# EAGLE design osmc_strip_2 (EAGLE 5.06)
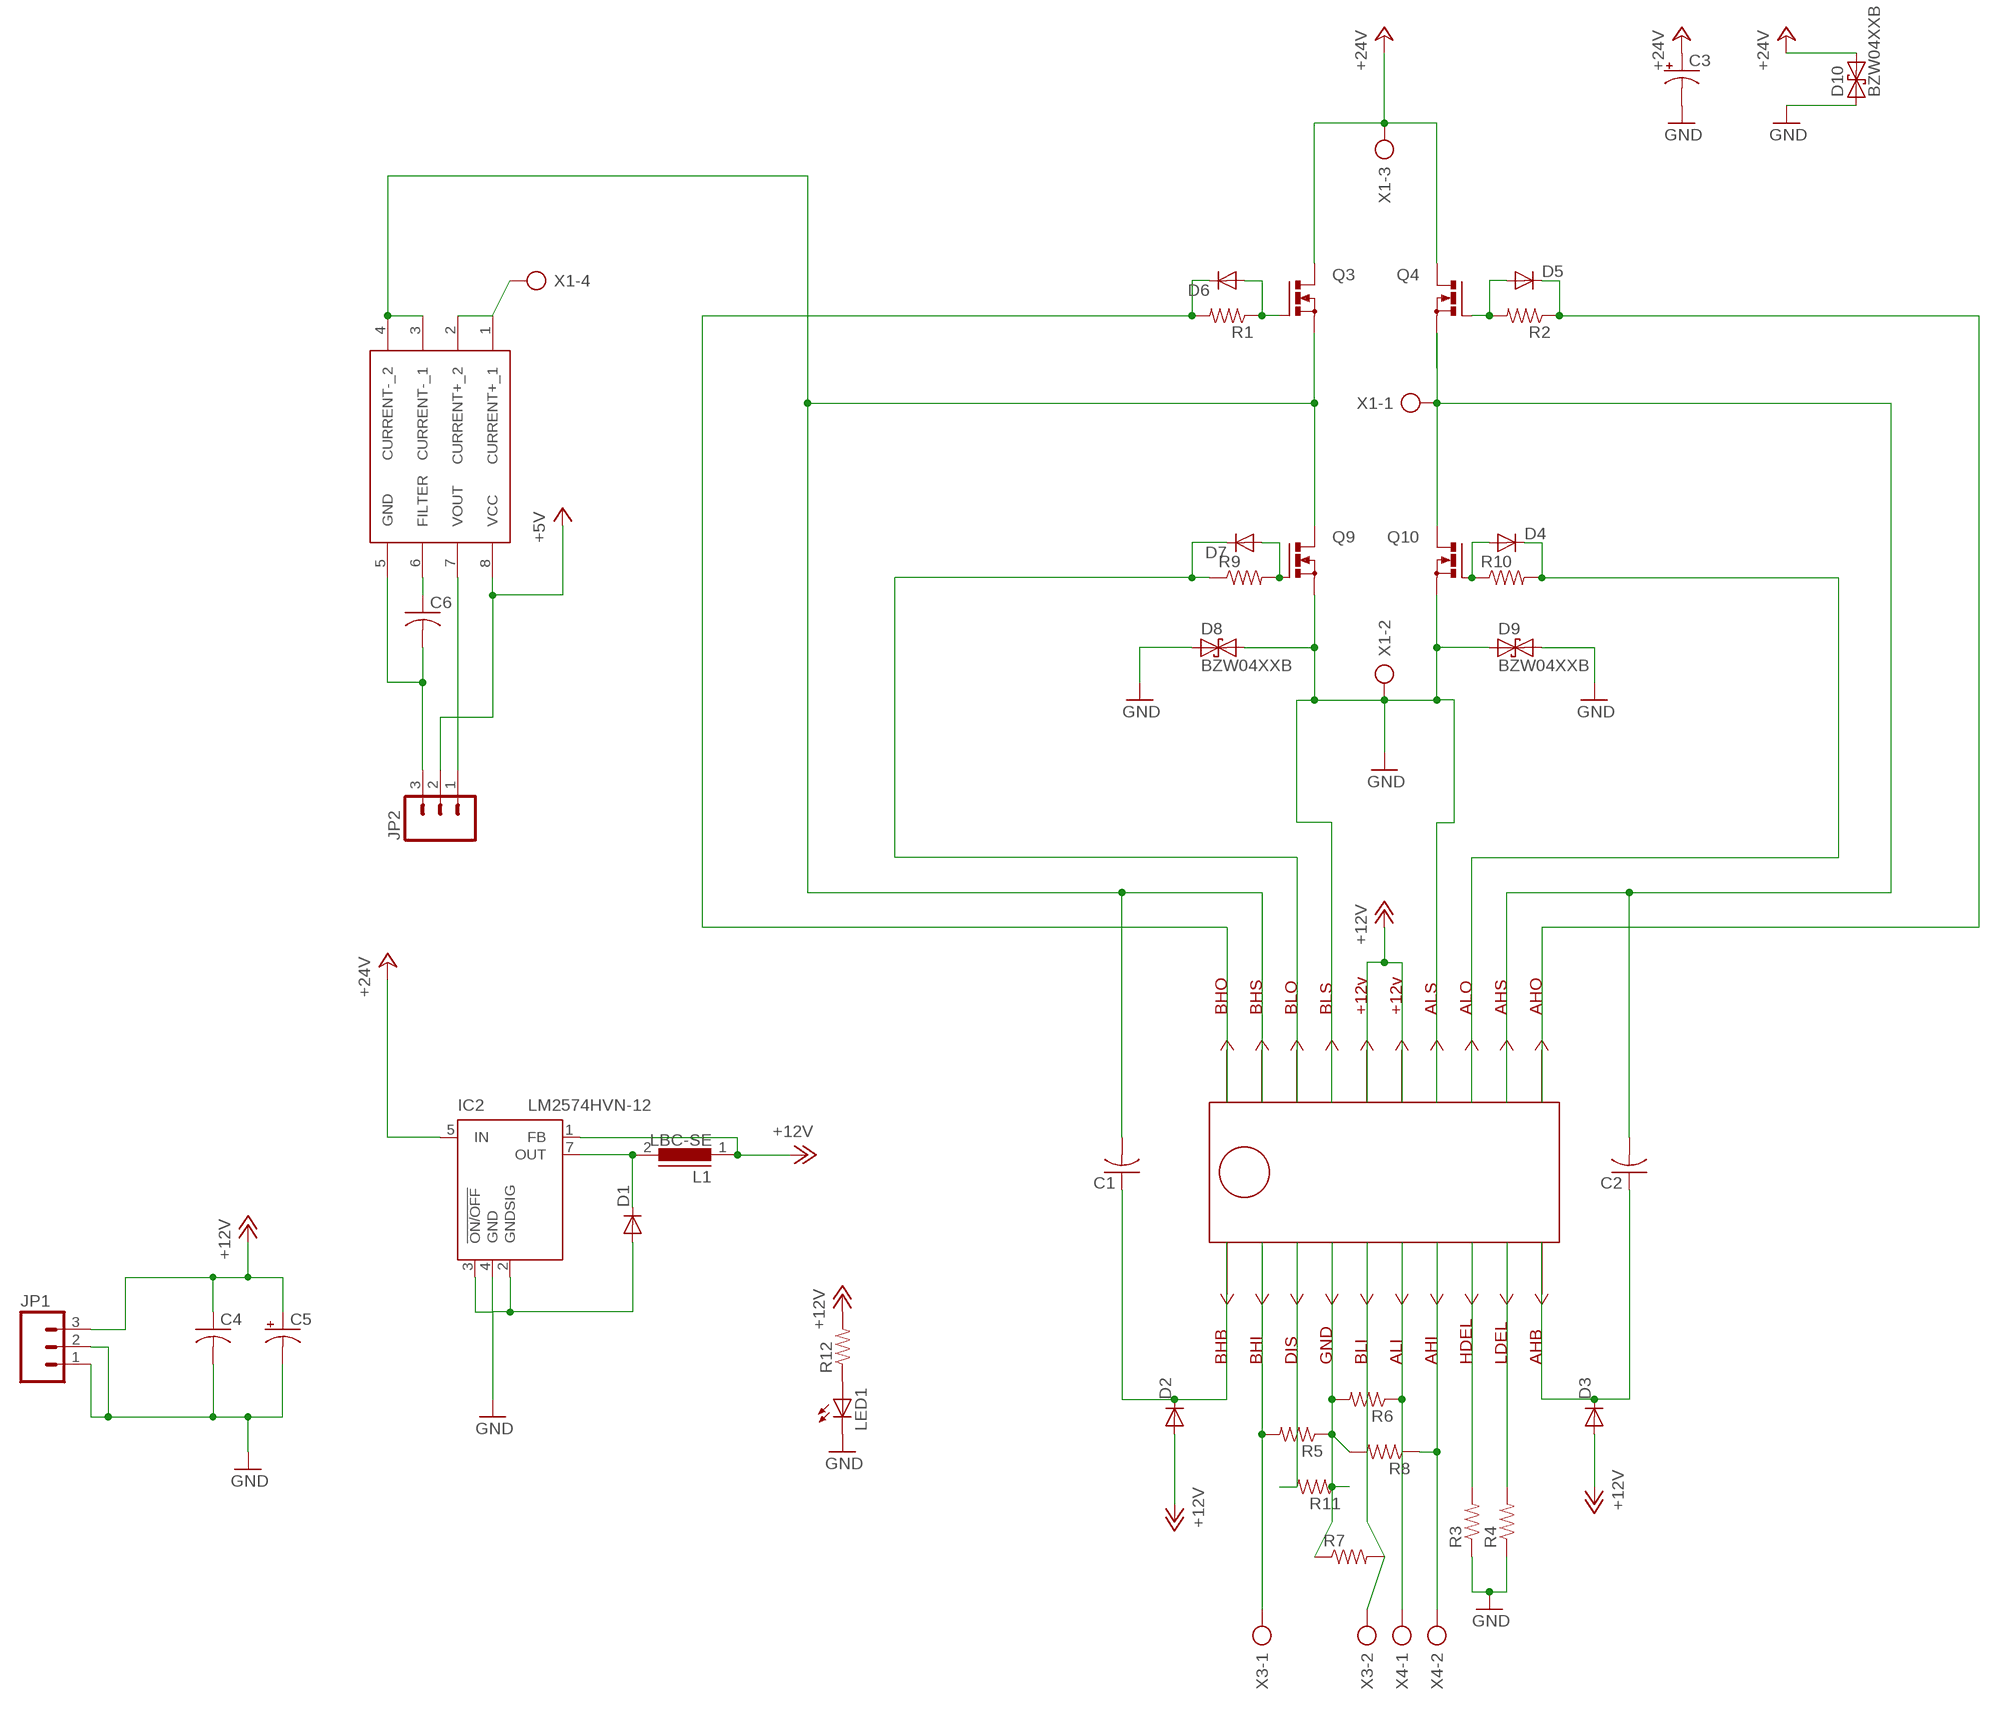
[diagram p0: schematic, sheet 1]

## Parts
C1  C-US075-032X103  [C075-032X103]
C2  C-US075-032X103  [C075-032X103]
C3  CPOL-USE5-13  [E5-13]
C4  C-US025-025X050  [C025-025X050]
C5  CPOL-USE5-8.5  [E5-8,5]
C6  C-US025-024X044  [C025-024X044]
D1  DIODEPTH  [DIODE-1N4001]
D2  DIODEPTH  [DIODE-1N4001]
D3  DIODEPTH  [DIODE-1N4001]
D4  DIODE1N4148  [DIODE-1N4148]
D5  DIODE1N4148  [DIODE-1N4148]
D6  DIODE1N4148  [DIODE-1N4148]
D7  DIODE1N4148  [DIODE-1N4148]
D8  BZW04XXB  [F126Z12]
D9  BZW04XXB  [F126Z12]
D10  BZW04XXB  [F126Z12]
IC1  HIP4081  [HIP4081]
IC2  LM2574HVN-12  [DIL08]
JP1  M03PTH  [1X03]
JP2  M03PTH  [1X03]
L1  LBC-SE  [LBC-SE]
LED1  LED3MM  [LED3MM]
Q3  PMOSFET_NTO220BV  [TO220BV]
Q4  PMOSFET_NTO220BV  [TO220BV]
Q9  PMOSFET_NTO220BV  [TO220BV]
Q10  PMOSFET_NTO220BV  [TO220BV]
R1  RESISTORPTH1  [AXIAL-0.3]
R2  RESISTORPTH1  [AXIAL-0.3]
R3  RESISTORPTH-1/6W  [1/6W-RES]
R4  RESISTORPTH-1/6W  [1/6W-RES]
R5  RESISTORPTH-1/6W  [1/6W-RES]
R6  RESISTORPTH-1/6W  [1/6W-RES]
R7  RESISTORPTH-1/6W  [1/6W-RES]
R8  RESISTORPTH-1/6W  [1/6W-RES]
R9  RESISTORPTH1  [AXIAL-0.3]
R10  RESISTORPTH1  [AXIAL-0.3]
R11  RESISTORPTH-1/6W  [1/6W-RES]
R12  RESISTORPTH-1/6W  [1/6W-RES]
U$1  ACS714  [ACS714]
X1  AK500/4  [AK500/4]
X3  AK500/2  [AK500/2]
X4  AK500/2  [AK500/2]

## Nets
+5V: JP2.2 U$1.8(VCC)
+12V: C4.1 C5.+ D2.A D3.A IC1.15(VCC) IC1.16(+12V) IC2.1(FB) JP1.3 L1.1 R12.2
+24V: C3.+ D10.C IC2.5(IN) Q3.D Q4.D X1.3
GND: C3.- C4.2 C5.- D1.A D8.A D8.C D9.A D9.C D10.A IC1.4(GND) IC1.14(ALS) IC1.17(BLS) IC2.2(GNDSIG) IC2.3(!ON/OFF) IC2.4(GND) JP1.1 JP1.2 LED1.K(C) Q9.S Q10.S R3.1 R4.1 R5.1 R6.2 R7.1 R8.2 R11.1 X1.2
N$2: C2.2 IC1.12(AHS) Q4.S Q10.D X1.1
N$3: D5.C IC1.11(AHO) R2.P$1
N$4: C1.1 D2.C IC1.1(BHB)
N$5: IC1.2(BHI) R5.2 X3.1
N$6: D5.A Q4.G R2.P$2
N$7: IC1.3(DIS) R11.2
N$8: D4.A Q10.G R10.P$1
N$9: IC1.7(AHI) R8.1 X4.2
N$10: IC1.5(BLI) R7.2 X3.2
N$11: IC1.6(ALI) R6.1 X4.1
N$12: D7.A Q9.G R9.P$2
N$13: C6.2 JP2.3 U$1.5(GND)
N$14: C2.1 D3.C IC1.10(AHB)
N$15: D1.C IC2.7(OUT) L1.2
N$16: IC1.8(HDEL) R3.2
N$17: LED1.A R12.1
N$18: JP2.1 U$1.7(VOUT)
N$19: D6.A Q3.G R1.P$1
N$20: D6.C IC1.20(BHO) R1.P$2
N$21: IC1.9(LDEL) R4.2
N$22: D7.C IC1.18(BLO) R9.P$1
N$23: D4.C IC1.13(ALO) R10.P$2
N$24: C6.1 U$1.6(FILTER)
N$25: U$1.2(CURRENT+_2) X1.4
N$26: C1.2 IC1.19(BHS) Q3.S Q9.D U$1.3(CURRENT-_1) U$1.4(CURRENT-_2)
Unconnected: U$1.1(CURRENT+_1)

## Library data of the parts
C1 C2 C4 C6 = rcl:C-US: CAPACITOR, American symbol
C3 = resistor:CPOL-US: POLARIZED CAPACITOR, American symbol
C5 = rcl:CPOL-US: POLARIZED CAPACITOR, American symbol
D1-D7 = SparkFun:DIODE: Diode These are standard reverse protection diodes and small signal diodes. SMA package can handle up to about 1A. SOD-323 can handle about 200mA. What the SOD-323 package when ordering, there are some mfgs out there that are 5-pin packages.
D8-D10 = diode:BZW04XXB: DIODE uni and bidirectional supressor diode
IC1 = A-JD3:HIP4081
IC2 = linear:LM2574?-*: SIMPLE SWITCHER 0.5A Step-Down Voltage Regulator Source: http://cache.national.com/ds/LM/LM2574.pdf
JP1 JP2 = SparkFun:M03: Header 3 Standard 3-pin 0.1" header. Use with straight break away headers (SKU : PRT-00116), right angle break away headers (PRT-00553), swiss pins (PRT-00743), machine pins (PRT-00117), and female headers (PRT-00115). Molex polarized connector foot print use with SKU : PRT-08232 with associated crimp pins and housings.
L1 = inductors:LBC-SE: INDUCTOR
LED1 = SparkFun:LED: LEDs Standard schematic elements and footprints for 5mm, 3mm, 1206, and 0603 sized LEDs. 5mm - Spark Fun Electronics SKU : COM-00529 (and others)
Q3 Q4 Q9 Q10 = transistor-power:PMOSFET_N: Power MOSFET N-Channel
R1-R12 = SparkFun:RESISTOR: Resistor Basic schematic elements and footprints for 0603, 1206, and PTH 1/10th watt (small) resistors.
U$1 = A-JD_work:ACS714
X1 = con-ptr500:AK500/4: CONNECTOR
X3 X4 = con-ptr500:AK500/2: CONNECTOR

## Board
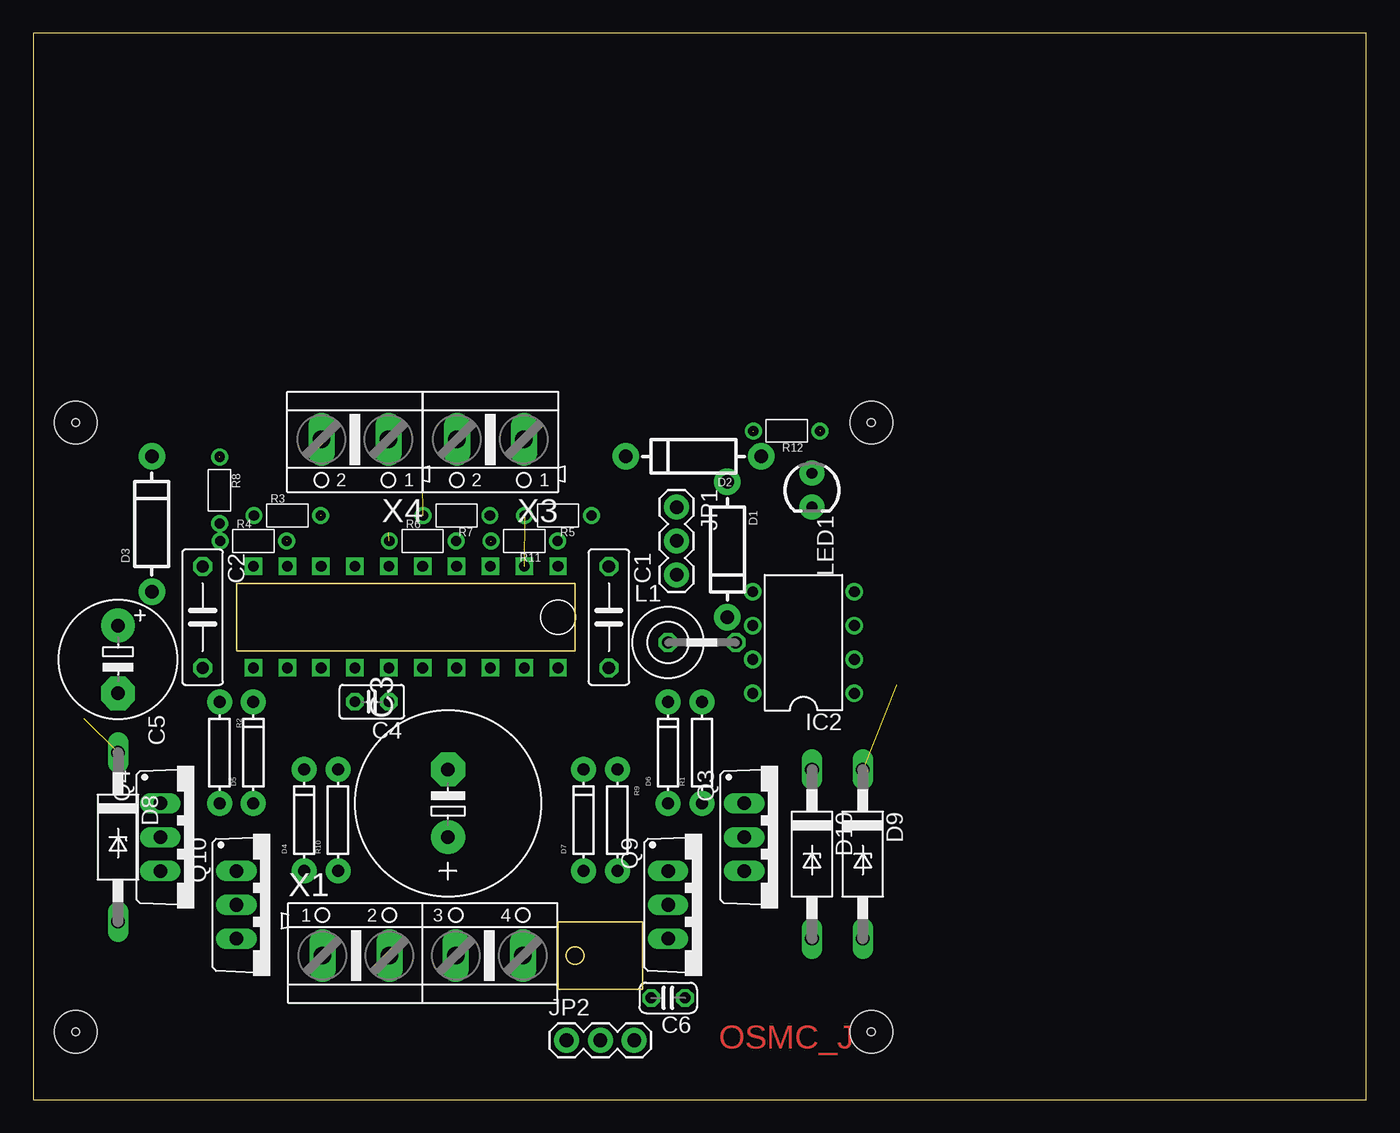
[diagram p1: board, top side]
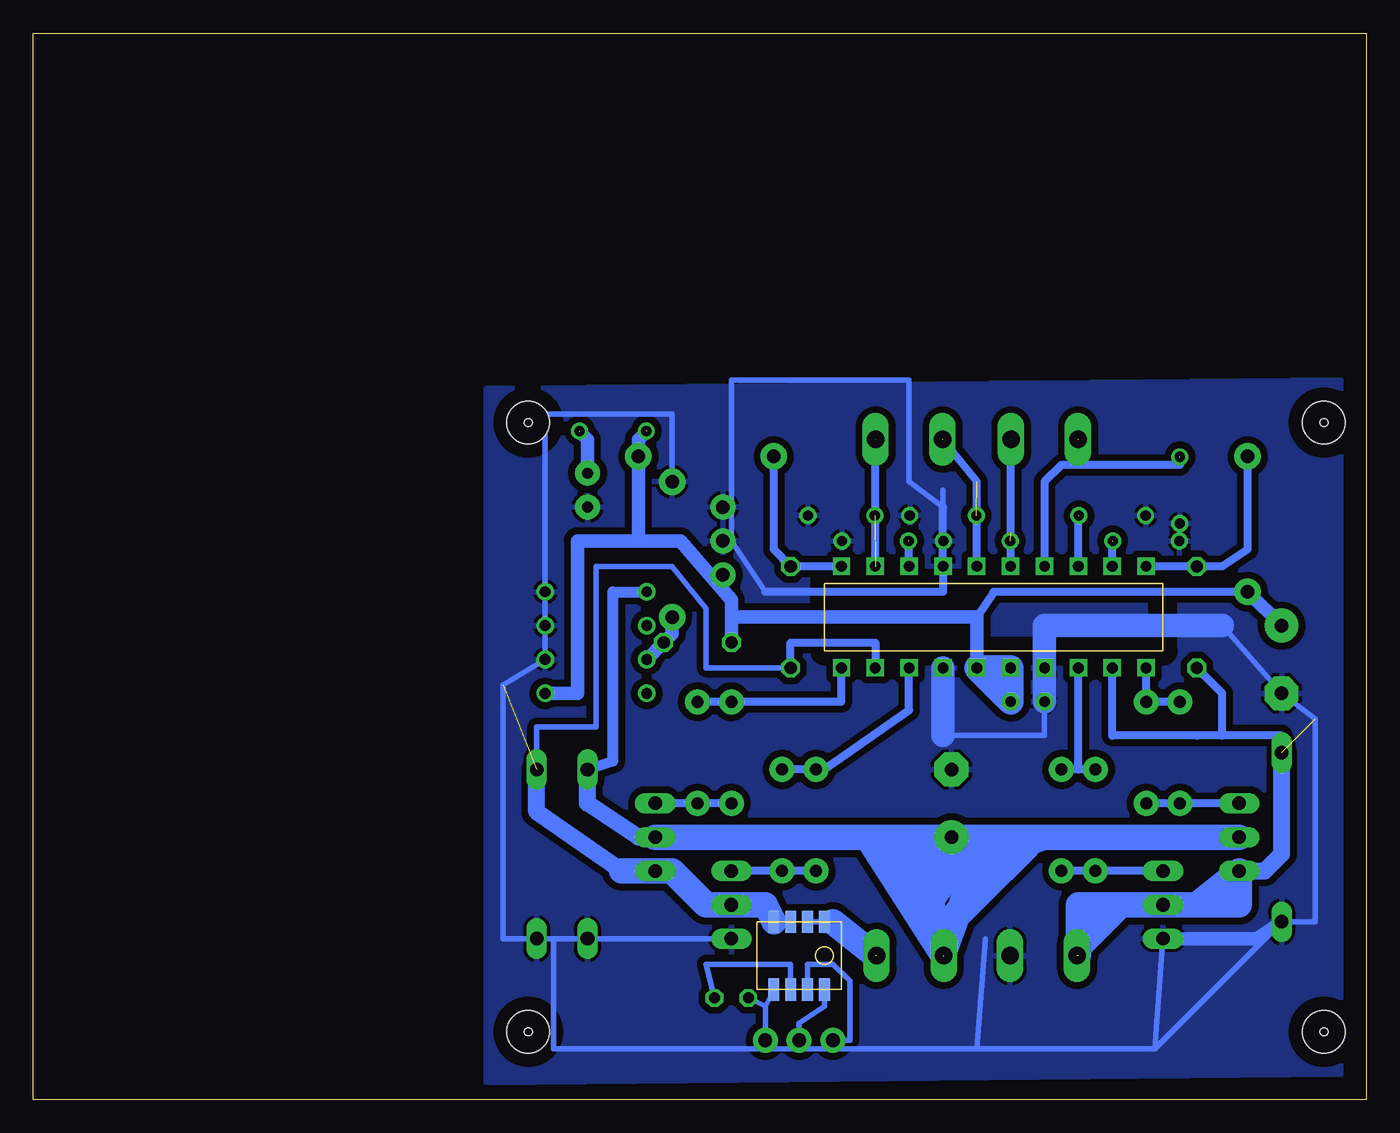
[diagram p2: board, bottom side, seen from below]

Size 100 x 80 mm. Coordinates in mm from the lower left corner, seen from the top.
Outline: 0,0 100,0 100,80 0,80 0,0
Copper layers (1*16): Top 0.035mm / dielectric 1.5mm / Bottom 0.035mm
Design rules "default *": minimum track width 10mil, minimum drill 24mil, track to track 20mil, track to pad 20mil, pad to pad 8mil, via to via 8mil, smd to smd 8mil, copper to edge 40mil, drill to drill 8mil, minimum pad ring 10mil, minimum via ring 8mil, stop-mask expansion 4mil, vias tented up to drill 0mil, thermal gap 10mil
Holes 0.6 mm at 62.87,5.08 3.17,5.08 3.17,50.8 62.87,50.8
Holes 3.2 mm at 3.17,5.08 62.87,5.08 62.87,50.8 3.17,50.8

### Footprints (pad centres in the part's own frame; a part is rotated, then mirrored left to right if it is on the bottom)
C075-032X103 = drill 0.914 octagon: 1 -3.81,0; 2 3.81,0
E5-13 = drill 1.016 pad 2.54 round: + -2.54,0 | drill 1.016 pad 2.54 octagon: - 2.54,0
C025-025X050 = drill 0.813 octagon: 1 -1.27,0; 2 1.27,0
E5-8,5 = drill 1.016 pad 2.54 round: + -2.54,0 | drill 1.016 pad 2.54 octagon: - 2.54,0
C025-024X044 = drill 0.813 octagon: 1 -1.27,0; 2 1.27,0
DIODE-1N4001 = drill 1 pad 1.981 round: A -5.08,0; C 5.08,0
DIODE-1N4148 = drill 0.9 pad 1.88 round: A -3.81,0; C 3.81,0
F126Z12 = drill 1.016 long: A 6.35,0; C -6.35,0
HIP4081 = drill 0.8 square: 1 -11.43,-3.81; 2 -8.89,-3.81; 3 -6.35,-3.81; 4 -3.81,-3.81; 5 -1.27,-3.81; 6 1.27,-3.81; 7 3.81,-3.81; 8 6.35,-3.81; 9 8.89,-3.81; 10 11.43,-3.81; 11 11.43,3.81; 12 8.89,3.81; 13 6.35,3.81; 14 3.81,3.81; 15 1.27,3.81; 16 -1.27,3.81; 17 -3.81,3.81; 18 -6.35,3.81; 19 -8.89,3.81; 20 -11.43,3.81
DIL08 = drill 0.813 pad 1.27 round: 1 -3.81,-3.81; 2 -1.27,-3.81; 3 1.27,-3.81; 4 3.81,-3.81; 5 3.81,3.81; 6 1.27,3.81; 7 -1.27,3.81; 8 -3.81,3.81
1X03 = drill 1.016 pad 1.88 round: 1 0,0; 2 2.54,0; 3 5.08,0
LBC-SE = drill 0.914 octagon: 1 -2.54,0; 2 2.54,0
LED3MM = drill 0.813 pad 1.88 round: A -1.27,0; K 1.27,0
TO220BV = drill 1.016 long: D 0,-2.54; G -2.54,-2.54; S 2.54,-2.54
AXIAL-0.3 = drill 0.9 pad 1.88 round: P$1 -3.81,0; P$2 3.81,0
1/6W-RES = drill 0.762 round: 1 -2.5,0; 2 2.5,0
ACS714 = smd 0.813 x 1.676: 1 -1.905,-2.54; 2 -0.635,-2.54; 3 0.635,-2.54; 4 1.905,-2.54; 5 1.905,2.54; 6 0.635,2.54; 7 -0.635,2.54; 8 -1.905,2.54
AK500/4 = drill 1.321 long: 1 -7.518,0; 2 -2.489,0; 3 2.489,0; 4 7.518,0
AK500/2 = drill 1.321 long: 1 -2.515,0; 2 2.515,0

### Placement (x,y rotation side)
C1  43.18,36.2 270 top
C2  12.7,36.2 270 top
C3  31.11,22.23 90 top
C4  25.4,29.84 180 top
C5  6.35,33.02 270 top
C6  47.62,7.62 180 top
D1  52.07,41.27 270 top
D2  49.53,48.26 180 top
D3  8.89,43.18 90 top
D4  20.32,20.95 90 top
D5  16.51,26.04 90 top
D6  47.62,26.04 90 top
D7  41.27,20.95 90 top
D8  6.35,19.68 270 top
D9  62.23,18.41 270 top
D10  58.42,18.41 270 top
IC1  27.94,36.2 180 top
IC2  57.78,34.29 90 top
JP1  48.26,44.45 270 top
JP2  40.01,4.45 0 top
L1  50.16,34.29 0 top
LED1  58.42,45.72 270 top
Q3  55.88,19.68 270 top
Q4  12.06,19.68 270 top
Q9  50.16,14.61 270 top
Q10  17.78,14.61 270 top
R1  50.16,26.04 90 top
R2  13.97,26.04 270 top
R3  19.05,43.81 0 top
R4  16.51,41.91 0 top
R5  39.37,43.81 180 top
R6  29.21,41.91 0 top
R7  31.75,43.81 180 top
R8  13.97,45.72 270 top
R9  43.81,20.95 270 top
R10  22.86,20.95 90 top
R11  36.83,41.91 180 top
R12  56.52,50.16 180 top
U$1  42.55,10.79 180 bottom
X1  29.21,10.79 0 top
X3  34.29,49.53 180 top
X4  24.13,49.53 180 top

### Tracks (layer width: path | path; a pad name or v marks a point on that pad's centre or on a via)
+5V
  Bottom 0.406: JP2.2 42.55,5.71 40.64,6.99 U$1.8
+12V  (1 unrouted)
  Bottom 0.406: C5.+ D3.A
  Bottom 0.61: 29.21,36.2 27.94,38.1 D3.A
  Bottom 0.813: JP1.3 48.26,38.1 47.62,37.47 L1.1
  Bottom 1.016: IC1.15 IC1.16 29.21,36.2 47.62,36.2 | 54.61,41.91 59.18,41.91 59.18,30.48 IC2.1 | 47.62,36.2 47.62,37.47 51.44,41.91 54.61,41.91 | 54.61,41.91 D2.A 54.61,49.53 53.98,50.16 | 47.62,36.2 L1.1 | C5.+ D3.A
  Bottom 1.93: C4.1 IC1.15 IC1.16 | IC1.16 C4.1 | IC1.16 C4.1
+24V  (1 unrouted)
  Bottom 0.813: IC2.5 56.52,38.1 56.52,25.4 D10.C
  Bottom 1.27: Q3.D 54.61,19.68 58.42,22.23 D10.C
  Bottom 1.93: 33.02,19.68 33.66,18.41 32.38,13.97 | 32.38,13.97 31.75,11.43 | C3.+ 33.02,19.68 | Q4.D 24.13,19.68 | 24.13,19.68 28.57,19.68 | 35.56,19.68 33.02,19.68 | 37.47,19.68 Q3.D | 28.57,19.68 31.75,10.79 37.47,19.68 | 28.57,19.68 29.21,19.68 | 29.21,19.68 C3.+ | 29.21,19.68 32.38,15.24 32.38,17.14 C3.+ | 37.47,19.68 35.56,19.68 | 35.56,19.68 32.38,13.97 | 31.75,12.7 29.84,15.24 28.57,18.41 25.4,19.05 | 26.04,19.05 31.75,12.7 | 31.75,12.7 29.21,15.24 | 29.21,15.24 28.57,15.88 | 24.13,19.68 26.04,19.05 | 26.04,19.05 25.4,19.05 | 25.4,19.05 29.21,15.24
GND  (2 unrouted)
  Bottom 0.406: 29.21,3.81 60.96,3.81 60.96,12.06 Q9.S 64.77,12.06 64.77,31.11 IC2.2 IC2.3 IC2.4 61.59,51.44 52.07,51.44 D1.A | 29.21,3.81 28.57,12.06 | 15.88,3.81 29.21,3.81 | 15.88,3.81 Q10.S | C4.2 24.13,27.3 31.75,27.3 | 10.79,35.56 C5.- 3.81,28.57 3.81,13.34 D8.A 15.88,3.81 | 31.75,45.72 31.75,44.45 34.29,46.35 34.29,53.98 47.62,53.98 47.62,41.91 45.09,38.1
  Bottom 0.61: 45.09,38.1 31.75,38.1 IC1.4 31.75,44.45
  Bottom 1.016: D8.A 8.26,12.06 Q10.S
  Bottom 1.778: C4.2 IC1.14 24.13,35.56 10.79,35.56 | 31.75,27.3 IC1.17
  pour Bottom: 66.04,53.34 66.04,1.27 1.91,1.91 1.91,53.98
N$2  (1 unrouted)
  Bottom 0.406: 12.7,27.3 10.79,27.3 | 6.35,26.04 6.35,27.3
  Bottom 0.61: 10.79,27.3 10.79,30.48 C2.2 | IC1.12 19.05,27.3 12.7,27.3 6.35,27.3
  Bottom 1.27: 6.35,26.04 6.35,18.41 7.62,17.14 Q4.S
  Bottom 1.93: 20.32,12.7 18.41,14.61 16.51,14.61 | 21.59,11.43 20.32,12.7 | 21.59,11.43 21.59,10.79 | 16.51,14.61 Q10.D 12.7,14.61 | 11.43,14.61 9.53,14.61 9.53,15.88 | 11.43,14.61 12.7,14.61 | 12.7,14.61 Q4.S 9.53,15.88 | 11.43,14.61 9.53,15.88 | 11.43,14.61 16.51,14.61 | 16.51,14.61 21.59,14.61 21.59,11.43 | 21.59,11.43 21.59,13.97 20.95,13.97 20.32,12.7 | 20.32,12.7 21.59,13.34
N$3
  Bottom 0.61: IC1.11 D5.C R2.P$1
N$4
  Bottom 0.406: IC1.1 C1.1
  Bottom 0.61: IC1.1 C1.1 44.45,41.27 D2.C
N$5  (2 unrouted)
  Bottom 0.61: IC1.2 36.83,49.53
N$6
  Bottom 0.61: Q4.G R2.P$2 D5.A
N$7  (1 unrouted)
  Bottom 0.61: IC1.3 34.29,41.91
N$8
  Bottom 0.61: R10.P$1 D4.A Q10.G
N$9  (2 unrouted)
  Bottom 0.61: 21.59,47.62 13.97,47.62 13.97,48.26 | 21.59,47.62 21.59,49.53 | 21.59,47.62 22.86,47.62 24.13,46.35 IC1.7
N$10  (2 unrouted)
  Bottom 0.61: IC1.5 29.21,46.35 31.75,49.53
N$11  (2 unrouted)
  Bottom 0.61: IC1.6 26.67,42.55 26.67,49.53
N$12
  Bottom 0.61: Q9.G R9.P$2 D7.A
N$13
  Bottom 0.406: 45.09,6.99 U$1.5 | 45.09,6.99 C6.2 | JP2.3 45.09,6.99
N$14
  Bottom 0.406: IC1.10 C2.1
  Bottom 0.61: IC1.10 10.79,40.01 8.89,41.27 D3.C
N$15
  Bottom 1.016: D1.C 52.07,34.92 L1.2 IC2.7
N$16  (1 unrouted)
  Bottom 0.61: IC1.8 21.59,43.81
N$17  (1 unrouted)
  Bottom 1.016: 59.05,50.16 58.42,49.53 LED1.A
N$18
  Bottom 0.406: JP2.1 38.73,4.45 38.73,8.89 40.01,10.16 41.91,10.16 U$1.7
N$19
  Bottom 0.61: D6.A R1.P$1 Q3.G
N$20
  Bottom 0.61: IC1.20 39.37,29.84 D6.C R1.P$2
N$21  (1 unrouted)
  Bottom 0.61: IC1.9 19.05,41.91
N$22
  Bottom 0.61: R9.P$1 D7.C 40.64,24.77 34.29,29.21 IC1.18
N$23
  Bottom 0.61: D4.C 21.59,24.77 | 21.59,24.77 R10.P$2 | 21.59,24.77 IC1.13
N$24
  Bottom 0.406: U$1.6 43.18,10.16 49.53,10.16 C6.1
N$25  (1 unrouted)
  Bottom 0.406: 40.01,13.34 U$1.2
  Bottom 1.93: 36.83,10.79 40.01,13.34
N$26  (1 unrouted)
  Bottom 0.406: 62.23,24.77 62.23,27.94 57.78,27.94 57.78,40.01 52.07,40.01 49.53,36.83 49.53,32.38 C1.2
  Bottom 0.61: C1.2 43.18,34.29 36.83,34.29 IC1.19
  Bottom 1.27: 55.88,17.14 62.23,21.59 62.23,24.77
  Bottom 1.93: U$1.4 45.09,14.61 Q9.D 49.53,14.61 52.07,17.14 Q3.S 55.88,17.14

### Text on the board
Top: OSMC_JD
dxf: OSMC_JD